# Altium schematic sheet Board.SchDoc
size A1; SheetNumber: 1; SheetTotal: 4
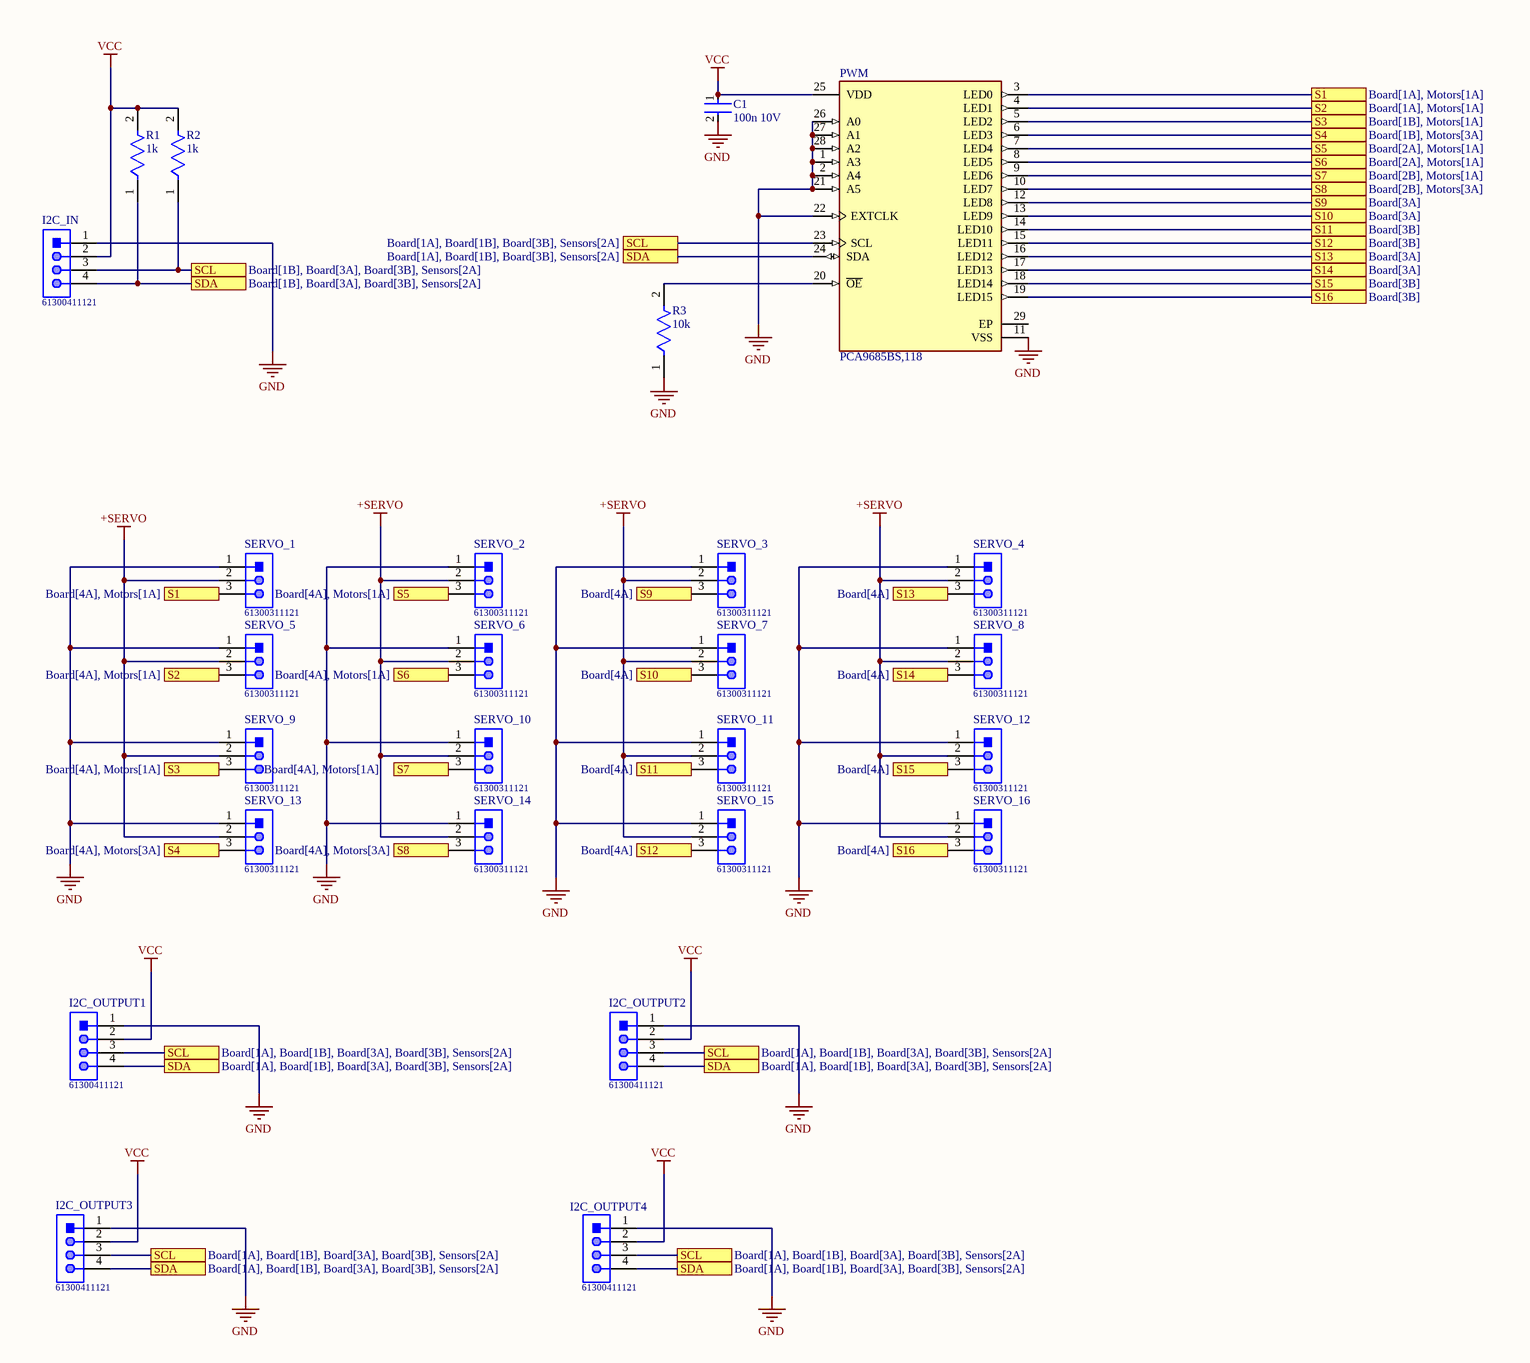
[diagram p0: Board.SchDoc]

## Parts
C1  100n 10V  [FP-GRM155-0_05-MFG]
I2C_IN  61300411121  [61300411121]
I2C_OUTPUT1  61300411121  [61300411121]
I2C_OUTPUT2  61300411121  [61300411121]
I2C_OUTPUT3  61300411121  [61300411121]
I2C_OUTPUT4  61300411121  [61300411121]
PWM  PCA9685BS,118  [FP-SOT788-1-IPC_B]
R1  1k  [FP-CRCW0402-e3-IPC_C]
R2  1k  [FP-CRCW0402-e3-IPC_C]
R3  10k  [FP-CRCW0402-e3-IPC_C]
SERVO_1  61300311121  [61300311121]
SERVO_2  61300311121  [61300311121]
SERVO_3  61300311121  [61300311121]
SERVO_4  61300311121  [61300311121]
SERVO_5  61300311121  [61300311121]
SERVO_6  61300311121  [61300311121]
SERVO_7  61300311121  [61300311121]
SERVO_8  61300311121  [61300311121]
SERVO_9  61300311121  [61300311121]
SERVO_10  61300311121  [61300311121]
SERVO_11  61300311121  [61300311121]
SERVO_12  61300311121  [61300311121]
SERVO_13  61300311121  [61300311121]
SERVO_14  61300311121  [61300311121]
SERVO_15  61300311121  [61300311121]
SERVO_16  61300311121  [61300311121]

## Ports
S1 (see Board[1A], Motors[1A]), S1 (see Board[4A], Motors[1A]), S2 (see Board[1A], Motors[1A]), S2 (see Board[4A], Motors[1A]), S3 (see Board[1B], Motors[1A]), S3 (see Board[4A], Motors[1A]), S4 (see Board[1B], Motors[3A]), S4 (see Board[4A], Motors[3A]), S5 (see Board[2A], Motors[1A]), S5 (see Board[4A], Motors[1A]), S6 (see Board[2A], Motors[1A]), S6 (see Board[4A], Motors[1A]), S7 (see Board[2B], Motors[1A]), S7 (see Board[4A], Motors[1A]), S8 (see Board[2B], Motors[3A]), S8 (see Board[4A], Motors[3A]), S9 (see Board[3A]), S9 (see Board[4A]), S10 (see Board[3A]), S10 (see Board[4A]), S11 (see Board[3B]), S11 (see Board[4A]), S12 (see Board[3B]), S12 (see Board[4A]), S13 (see Board[3A]), S13 (see Board[4A]), S14 (see Board[3A]), S14 (see Board[4A]), S15 (see Board[3B]), S15 (see Board[4A]), S16 (see Board[3B]), S16 (see Board[4A]), SCL (see Board[1A], Board[1B], Board[3A], Board[3B], Sensors[2A]), SCL (see Board[1A], Board[1B], Board[3B], Sensors[2A]), SCL (see Board[1B], Board[3A], Board[3B], Sensors[2A]), SDA (see Board[1A], Board[1B], Board[3A], Board[3B], Sensors[2A]), SDA (see Board[1A], Board[1B], Board[3B], Sensors[2A]), SDA (see Board[1B], Board[3A], Board[3B], Sensors[2A])

## Nets
+SERVO: SERVO_1.2 SERVO_2.2 SERVO_3.2 SERVO_4.2 SERVO_5.2 SERVO_6.2 SERVO_7.2 SERVO_8.2 SERVO_9.2 SERVO_10.2 SERVO_11.2 SERVO_12.2 SERVO_13.2 SERVO_14.2 SERVO_15.2 SERVO_16.2
GND: C1.2 I2C_IN.1 I2C_OUTPUT1.1 I2C_OUTPUT2.1 I2C_OUTPUT3.1 I2C_OUTPUT4.1 PWM.1(A3) PWM.2(A4) PWM.11(VSS) PWM.21(A5) PWM.22(EXTCLK) PWM.26(A0) PWM.27(A1) PWM.28(A2) R3.1 SERVO_1.1 SERVO_2.1 SERVO_3.1 SERVO_4.1 SERVO_5.1 SERVO_6.1 SERVO_7.1 SERVO_8.1 SERVO_9.1 SERVO_10.1 SERVO_11.1 SERVO_12.1 SERVO_13.1 SERVO_14.1 SERVO_15.1 SERVO_16.1
VCC: C1.1 I2C_IN.2 I2C_OUTPUT1.2 I2C_OUTPUT2.2 I2C_OUTPUT3.2 I2C_OUTPUT4.2 PWM.25(VDD) R1.2 R2.2
S1: PWM.3(LED0) SERVO_1.3 ; port S1
S2: PWM.4(LED1) SERVO_5.3 ; port S2
S3: PWM.5(LED2) SERVO_9.3 ; port S3
S4: PWM.6(LED3) SERVO_13.3 ; port S4
S5: PWM.7(LED4) SERVO_2.3 ; port S5
S6: PWM.8(LED5) SERVO_6.3 ; port S6
S7: PWM.9(LED6) SERVO_10.3 ; port S7
S8: PWM.10(LED7) SERVO_14.3 ; port S8
S9: PWM.12(LED8) SERVO_3.3 ; port S9
S10: PWM.13(LED9) SERVO_7.3 ; port S10
S11: PWM.14(LED10) SERVO_11.3 ; port S11
S12: PWM.15(LED11) SERVO_15.3 ; port S12
S13: PWM.16(LED12) SERVO_4.3 ; port S13
S14: PWM.17(LED13) SERVO_8.3 ; port S14
S15: PWM.18(LED14) SERVO_12.3 ; port S15
S16: PWM.19(LED15) SERVO_16.3 ; port S16
SCL: I2C_IN.3 I2C_OUTPUT1.3 I2C_OUTPUT2.3 I2C_OUTPUT3.3 I2C_OUTPUT4.3 PWM.23(SCL) R2.1 ; port SCL
SDA: I2C_IN.4 I2C_OUTPUT1.4 I2C_OUTPUT2.4 I2C_OUTPUT3.4 I2C_OUTPUT4.4 PWM.24(SDA) R1.1 ; port SDA
NetPWM_20: PWM.20(~{OE}) R3.2

Not connected (* = marked no-connect by the designer): PWM 29(EP)

## Library data of the parts
C1 = CMP-2008-04345-2: Chip Multilayer Ceramic Capacitors for General Purpose, 0402, 390pF, C0G, 30ppm/°C, 5%, 50V; REACH SVHC: No SVHC; Case Code (Metric): 1005; Thickness: 0.022inch; Lead Free: Lead Free; Case/Package: 0402; Min Operating Temperature: -55°C; Mount: Surface Mount; Length: 1mm; Depth: 0.5mm; Package Quantity: 1; Tolerance: 5%; Case Code (Imperial): 0402; Temperature Coefficient: 30ppm/°C; Packaging: Tape and Reel; Voltage Rating (DC): 50V; Material: Ceramic; Voltage Rating: 50V; Max Operating Temperature: 125°C; Voltage: 50V; Radiation Hardening: No; Capacitance: 390pF; Termination: SMD/SMT; Height: 0.5mm; Dielectric: C0G; Width: 0.02inch
I2C_IN I2C_OUTPUT1-I2C_OUTPUT4 = CMP-1502-01064-1: THT Vertical Pin Header WR-PHD, Pitch 2.54 mm, Single Row, 4 pins; Manufacturer: Wurth Elektronik; Withstanding Voltage: 500VAC; Rated Current: 3A; Working Voltage: 250VAC; Pin Number: 4; Gender: Male; Contact Resistance: 20mOhm; Pitch: 2.54mm; Manufacturer URL: http://www.we-online.de; Operating Temperature: -40to105degC; Packaging: Bag; Mounting Technology: THT; Package Reference: 61300411121; Datasheet URL: https://katalog.we-online.de/em/datasheet/6130xx11121.pdf; Publisher: WurthElektronik; Part Number: 61300411121; Row Number: Single; Orientation: Vertical
PWM = CMP-1595-00001-4: IC LED DRVR LIN DIM 25MA 28HVQFN; Number of Outputs: 16; Output Voltage: 5.5V; Frequency: 50MHz; Min Operating Temperature: -40°C; Package Quantity: 4000; Case/Package: VQFN; Number of Pins: 28; Contact Plating: Gold; Radiation Hardening: No; RoHS Compliant: Yes; Packaging: Tape and Reel; Mount: Surface Mount; Max Operating Temperature: 85°C
R1-R3 = CMP-2002-08122-2: RES Thick Film, 0Ω, 0.063W, 0402; Tolerance: 5%; Max Power Dissipation: 63mW; Voltage Rating: 50V; Temperature Coefficient: 100ppm/°C; Resistance: 0mR; Contact Plating: Tin; Height: 0.35mm; Radiation Hardening: No; Features: Automotive AEC-Q200; Composition: Thick Film; Width: 0.5mm; Weight: 2.3E-05oz; Termination: SMD/SMT; Packaging: Tape and Reel; Mount: Surface Mount; Case Code (Metric): 1005; Military Standard: Not; Min Operating Temperature: -55°C; Number of Terminations: 2; Package Quantity: 1; Case Code (Imperial): 0402; Depth: 0.5mm; Max Operating Temperature: 155°C; Case/Package: 0402; Power Rating: 63mW; Lead Free: Lead Free; Voltage Rating (DC): 50V; Length: 1mm
SERVO_1-SERVO_16 = CMP-1502-01062-1: THT Vertical Pin Header WR-PHD, Pitch 2.54 mm, Single Row, 3 pins; Manufacturer: Wurth Elektronik; Withstanding Voltage: 500VAC; Working Voltage: 250VAC; Rated Current: 3A; Pitch: 2.54mm; Pin Number: 3; Gender: Male; Contact Resistance: 20mOhm; Package Reference: 61300311121; Manufacturer URL: http://www.we-online.de; Datasheet URL: https://katalog.we-online.de/em/datasheet/6130xx11121.pdf; Operating Temperature: -40to105degC; Part Number: 61300311121; Orientation: Vertical; Packaging: Bag; Row Number: Single; Mounting Technology: THT; Publisher: WurthElektronik